# Altium schematic sheet FPGA_ADC2.SchDoc
size A4
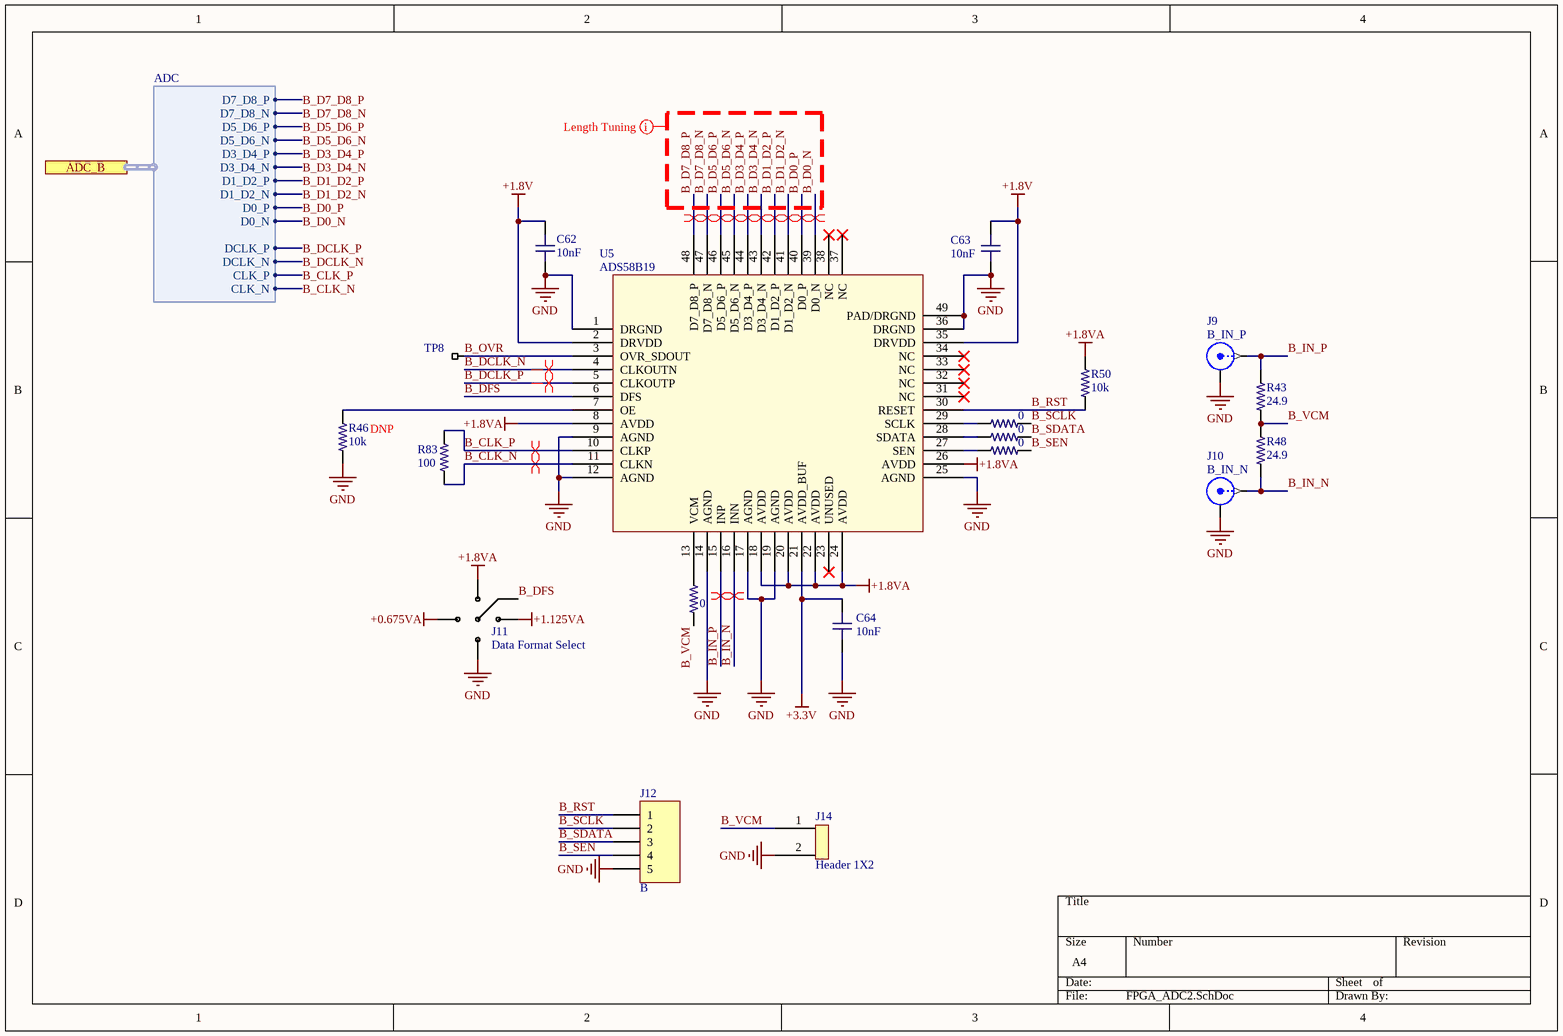
[diagram p0: FPGA_ADC2.SchDoc]

## Parts
C62  value 10nF  [C0603-HIGH-DENSITY]  (hidden comment: C0603 10nF 50V X7R)
C63  value 10nF  [C0603-HIGH-DENSITY]  (hidden comment: C0603 10nF 50V X7R)
C64  value 10nF  [C0603-HIGH-DENSITY]  (hidden comment: C0603 10nF 50V X7R)
J9  B_IN_P  [SMA Edge Launch (Horizontal)]
J10  B_IN_N  [SMA Edge Launch (Horizontal)]
J11  Data Format Select  [4P Jumper]
J12  B  [HDR1X5]
J14  Header 1X2  [Header 1x2 TH Pitch 2.54mm]
R43  value 24.9  [R0603-HIGH-DENSITY]  (hidden comment: RC0603FR-0724R9L)
R44  value 0  [R0603-IPC]  (hidden comment: R0603 0)
R45  value 0  [R0603-IPC]  (hidden comment: R0603 0)
R46  value 10k  [R0603-IPC-10K]  (hidden comment: R0603 10K 1%)
R47  value 0  [R0603-IPC]  (hidden comment: R0603 0)
R48  value 24.9  [R0603-HIGH-DENSITY]  (hidden comment: RC0603FR-0724R9L)
R49  value 0  [R0603-IPC]  (hidden comment: R0603 0)
R50  value 10k  [R0603-IPC-10K]  (hidden comment: R0603 10K 1%)
R83  value 100  [R0402-HIGH-DENSITY]  (hidden comment: R0402 100R 1%)
TP8  Testpoint_SMT  [TESTPOINT_SMT]  (value not drawn)  (no BOM)
U5  ADS58B19  [VQFN48]

## Ports
ADC_B (harness ADC)

## Harnesses
ADC: D7_D8_P, D7_D8_N, D5_D6_P, D5_D6_N, D3_D4_P, D3_D4_N, D1_D2_P, D1_D2_N, D0_P, D0_N, CLK_P, CLK_N, DCLK_P, DCLK_N

## Nets
+0.675VA: J11.4
+1.8V: C62.1 C63.1 U5.2(DRVDD) U5.35(DRVDD)
+1.8VA: J11.1 R50.2 U5.8(AVDD) U5.18(AVDD) U5.20(AVDD) U5.22(AVDD) U5.24(AVDD) U5.26(AVDD)
+1.125VA: J11.2
+3.3V: C64.1 U5.21(AVDD_BUF)
GND: C62.2 C63.2 C64.2 J9.2(Y) J10.2(Y) J11.3 J12.5 J14.2 R46.1 U5.1(DRGND) U5.9(AGND) U5.12(AGND) U5.14(AGND) U5.17(AGND) U5.19(AGND) U5.25(AGND) U5.36(DRGND) U5.49(PAD/DRGND)
B_CLK_N: R83.1 U5.11(CLKN) ; port ADC_B.CLK_N
B_CLK_P: R83.2 U5.10(CLKP) ; port ADC_B.CLK_P
B_D0_N: U5.39(D0_N) ; port ADC_B.D0_N
B_D0_P: U5.40(D0_P) ; port ADC_B.D0_P
B_D1_D2_N: U5.41(D1_D2_N) ; port ADC_B.D1_D2_N
B_D1_D2_P: U5.42(D1_D2_P) ; port ADC_B.D1_D2_P
B_D3_D4_N: U5.43(D3_D4_N) ; port ADC_B.D3_D4_N
B_D3_D4_P: U5.44(D3_D4_P) ; port ADC_B.D3_D4_P
B_D5_D6_N: U5.45(D5_D6_N) ; port ADC_B.D5_D6_N
B_D5_D6_P: U5.46(D5_D6_P) ; port ADC_B.D5_D6_P
B_D7_D8_N: U5.47(D7_D8_N) ; port ADC_B.D7_D8_N
B_D7_D8_P: U5.48(D7_D8_P) ; port ADC_B.D7_D8_P
B_DCLK_N: U5.4(CLKOUTN) ; port ADC_B.DCLK_N
B_DCLK_P: U5.5(CLKOUTP) ; port ADC_B.DCLK_P
B_DFS: J11.5 U5.6(DFS)
B_IN_N: J10.1(X) R48.1 U5.16(INN)
B_IN_P: J9.1(X) R43.2 U5.15(INP)
B_OVR: TP8.1 U5.3(OVR_SDOUT)
B_RST: J12.1 R50.1 U5.30(RESET)
B_SCLK: J12.2 R44.2
B_SDATA: J12.3 R45.2
B_SEN: J12.4 R47.2
B_VCM: J14.1 R43.1 R48.2 R49.2
NetR44_1: R44.1 U5.29(SCLK)
NetR45_1: R45.1 U5.28(SDATA)
NetR46_2: R46.2 U5.7(OE)
NetR47_1: R47.1 U5.27(SEN)
NetR49_1: R49.1 U5.13(VCM)

Not connected (* = marked no-connect by the designer): U5 23(UNUSED)* 31(NC)* 32(NC)* 33(NC)* 34(NC)* 37(NC)* 38(NC)*

## Layout directives
differential pair: B_D0_N, B_D0_P, B_D1_D2_N, B_D1_D2_P, B_D3_D4_N, B_D3_D4_P, B_D5_D6_N, B_D5_D6_P, B_D7_D8_N, B_D7_D8_P
differential pair; differential pair class AnalogIn: B_IN_N, B_IN_P
differential pair; differential pair class ADC_CLK: B_CLK_N, B_CLK_P, B_DCLK_N, B_DCLK_P
net class ADC_DATA - 150mil; net class ADC_DATA_B: B_D0_N, B_D0_P, B_D1_D2_N, B_D1_D2_P, B_D3_D4_N, B_D3_D4_P, B_D5_D6_N, B_D5_D6_P, B_D7_D8_N, B_D7_D8_P

## Notes on the sheet
- (near R46) DNP

## Library data of the parts
C62-C64 = C0603 10nF 50V X7R: CAP CER 10000PF 50V X7R 0603; EIA Code: X7R; Max. Voltage: 50V; Features: Soft Termination; Supplier 1: Digi-Key; Supplier Part Number 1: 490-10892-1-ND
J9 J10 = SMA: SMA Connector; Supplier 1: Digi-Key; Supplier Part Number 1: A97594-ND
J11 = 4P Jumper: 0603 4 Way Solder Jumper
J12 = Header 5: Header, 5-Pin; LatestRevisionDate: 17-Jul-2002; LatestRevisionNote: Re-released for DXP Platform.; Publisher: Altium Limited
R43 R48 = R0603 24.9R 1%: Chip Resistor, 0603, 24.9 ohms, 0.1W; Supplier 1: Digi-Key; Supplier 2: Mouser; Supplier Part Number 1: 311-24.9HRCT-ND; Supplier Part Number 2: 603-RC0603FR-0724R9L
R44 R45 R47 R49 = R0603 0: RES SMD 0 OHM JUMPER 1/10W 0603; Supplier 1: Digi-Key; Supplier Part Number 1: RMCF0603ZT0R00CT-ND
R46 R50 = R0603 10K 1%: RES SMD 10K OHM 1% 1/10W 0603; Supplier 1: Digi-Key; Supplier Part Number 1: RMCF0603FT10K0CT-ND
R83 = R0402 100R 1%: Chip Resistor, 0402, 100 ohms, 1%, 1/16 W; Supplier 1: Digi-Key; Supplier Part Number 1: 311-100LRCT-ND
TP8 = Testpoint_SMT: SMT Test Point
U5 = ADS58B19: Single ADC Pipelined 250Msps 9-bit Parallel/LVDS 48-Pin VQFN; Supplier 1: Digi-Key; Supplier 2: Mouser; Supplier Part Number 1: 296-28296-1-ND; Supplier Part Number 2: 595-ADS58B19IRGZT